# Altium schematic sheet 07.SchDoc
size 297 x 209 mm
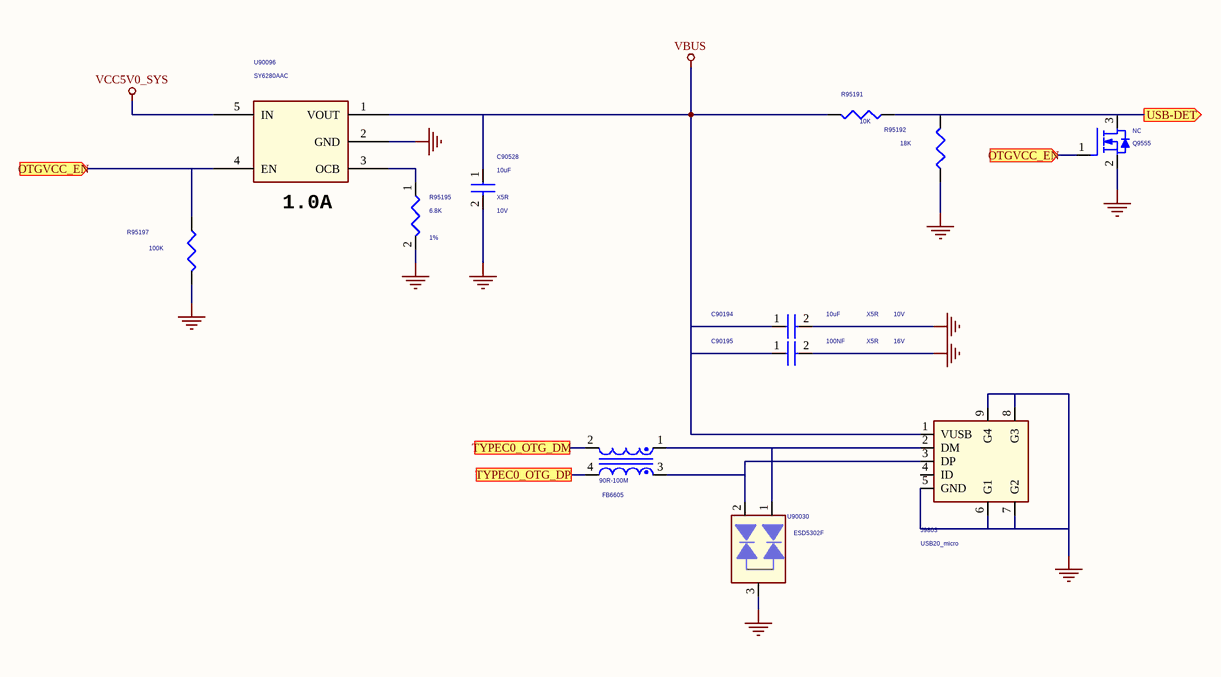
[diagram p0: 07.SchDoc]

## Parts
C90194  10uF  Voltage: 10V  Dielectric: X5R  [C0603]
C90195  100NF  Voltage: 16V  Dielectric: X5R  [C0402]
C90528  10uF  Voltage: 10V  Dielectric: X5R  [C0603]
FB6605  90R-100M  [L0402D]
J9803  USB20_micro  [USB-5PAA]
Q9555  NC  [SOT23]
R95191  10K  [R0402]
R95192  18K  [R0402]
R95195  6.8K  Tolerance: 1%  [R0402]
R95197  100K  [R0402]
U90030  ESD5302F  [SOT23]
U90096  SY6280AAC  [SOT_23_5]

## Ports
OTGVCC_EN (in), TYPEC0_OTG_DM, TYPEC0_OTG_DP, USB-DET (out)

## Nets
GND: C90194.2 C90195.2 C90528.2 J9803.5(GND) J9803.6(G1) J9803.7(G2) J9803.8(G3) J9803.9(G4) Q9555.2(SOURCE) R95192.2 R95195.2 R95197.1 U90030.3 U90096.2(GND)
VBUS: C90194.1 C90195.1 C90528.1 J9803.1(VUSB) R95191.2 U90096.1(VOUT)
VCC5V0_SYS: U90096.5(IN)
OTGVCC_EN: Q9555.1(GATE) R95197.2 U90096.4(EN) ; port OTGVCC_EN
TYPEC0_OTG_DM: FB6605.2 ; port TYPEC0_OTG_DM
TYPEC0_OTG_DP: FB6605.4 ; port TYPEC0_OTG_DP
USB-DET: Q9555.3(DRAIN) R95191.1 R95192.1 ; port USB-DET
NetFB6605_1: FB6605.1 J9803.2(DM) U90030.1
NetFB6605_3: FB6605.3 J9803.3(DP) U90030.2
NetR95195_1: R95195.1 U90096.3(OCB)

Not connected (* = marked no-connect by the designer): J9803 4(ID)

## Notes on the sheet
- (near U90096) 1.0A

## Library data of the parts
C90194 = CAP NP: cap,10.00uF,+/-10%,10V,X5R,C0805; Manufacturer: TDK; RK PN: C2012X5R1A106K125AB; Priority: A; Tolerance: 10%; Part Type: C0805; Manufacturer PN: C2012X5R1A106K125AB; Created by: JJJ
C90195 = CAP NP: cap,100.00nF,+/-10%,16V,X5R,C0402; Manufacturer: TDK; RK PN: C1005X5R1C104K050BA; Priority: A; Tolerance: 10%; Part Type: C0402; Manufacturer PN: C1005X5R1C104K050BA; Created by: JJJ
C90528 = CAP NP: cap,10.00uF,+/-10%,10V,X5R,C0805; Manufacturer PN: C2012X5R1A106K125AB; Manufacturer: TDK; Tolerance: 10%; Priority: A; Created by: JJJ; Part Type: C0805; RK PN: C2012X5R1A106K125AB
FB6605 = INDUCTOR COM: Multi-layer common mode filter array For high-speed differential signal lines.Differential mode cut-off frequency:MCZ1210AH series : 2.5GHz typ.MCZ1210CH series : 3.5GHz typ.MCZ1210DH series : 4 to 6GHz typ.; Manufacturer: EMC; RK PN: MCZ1210AH900L2T; Priority: A; DC Resistor: 1.75ohm; Irms: 200mA; Resonace frequency: 90R@100M; Part Type: BEAD; Manufacturer PN: MCZ1210AH900L2T; Created by: JJJ
J9803 = USB20_MICRO: micro型USB2.0座，卧式，贴焊; Manufacturer: 祺华电子; Priority: A; RK PN: USB20_micro; Part Type: USB Jack; Manufacturer Part Number: USB20_micro; Created by: JJJ
Q9555 = MOSFET N_0: NMOS,2SK3018,SOT_323,Id=0.1A,Vds=30V; Manufacturer: ROHM; Rds: 5ohm; Priority: A; Id_max: 0.1A; Vgs: 20V; VDS: 30V; Vgsth: 1.5V; Pd: 0.2W; RK PN: 2SK3018; Part Type: NMOS; Manufacturer PN: 2SK3018; Created by: JJJ
R95191 = RESISTOR_1: RES,thick film,47KOhm,+/-5%,1/16W,SMD0402
R95192 = RESISTOR_0: RES,thick film,47KOhm,+/-5%,1/16W,SMD0402; MARK: 51K
R95195 = RESISTOR: 通用厚膜电阻,9K1,+/-1%,R0402,1/16W.; Manufacturer PN: RC0402FR-079K1L; Manufacturer: YAGEO; Wattage: 1/16W; Priority: A; Created by: YTL; Part Type: 通用厚膜电阻; RK PN: RC0402FR-079K1L
R95197 = R_2
U90030 = ESD_ESDA6V8UL: 2-Lines, Uni-directional,Ultra-low Capacitance.Transient Voltage Suppressors; Manufacturer: WillSemi(韦尔半导体); Priority: A; RK PN: ESD5302F; Part Type: ESD_TVS; Manufacturer PN: ESD5302F; Created by: JJJ
U90096 = SWITCH_SY6280: Low Loss Power Distribution Switch; Manufacturer: Silergy（矽力杰）; Priority: A; RK PN: SY6280AAC; Part Type: Switch; Manufacturer PN: SY6280AAC; Created by: JJJ